# Altium schematic sheet LM5116.SchDoc
size A3; SheetNumber: 1; SheetTotal: 5
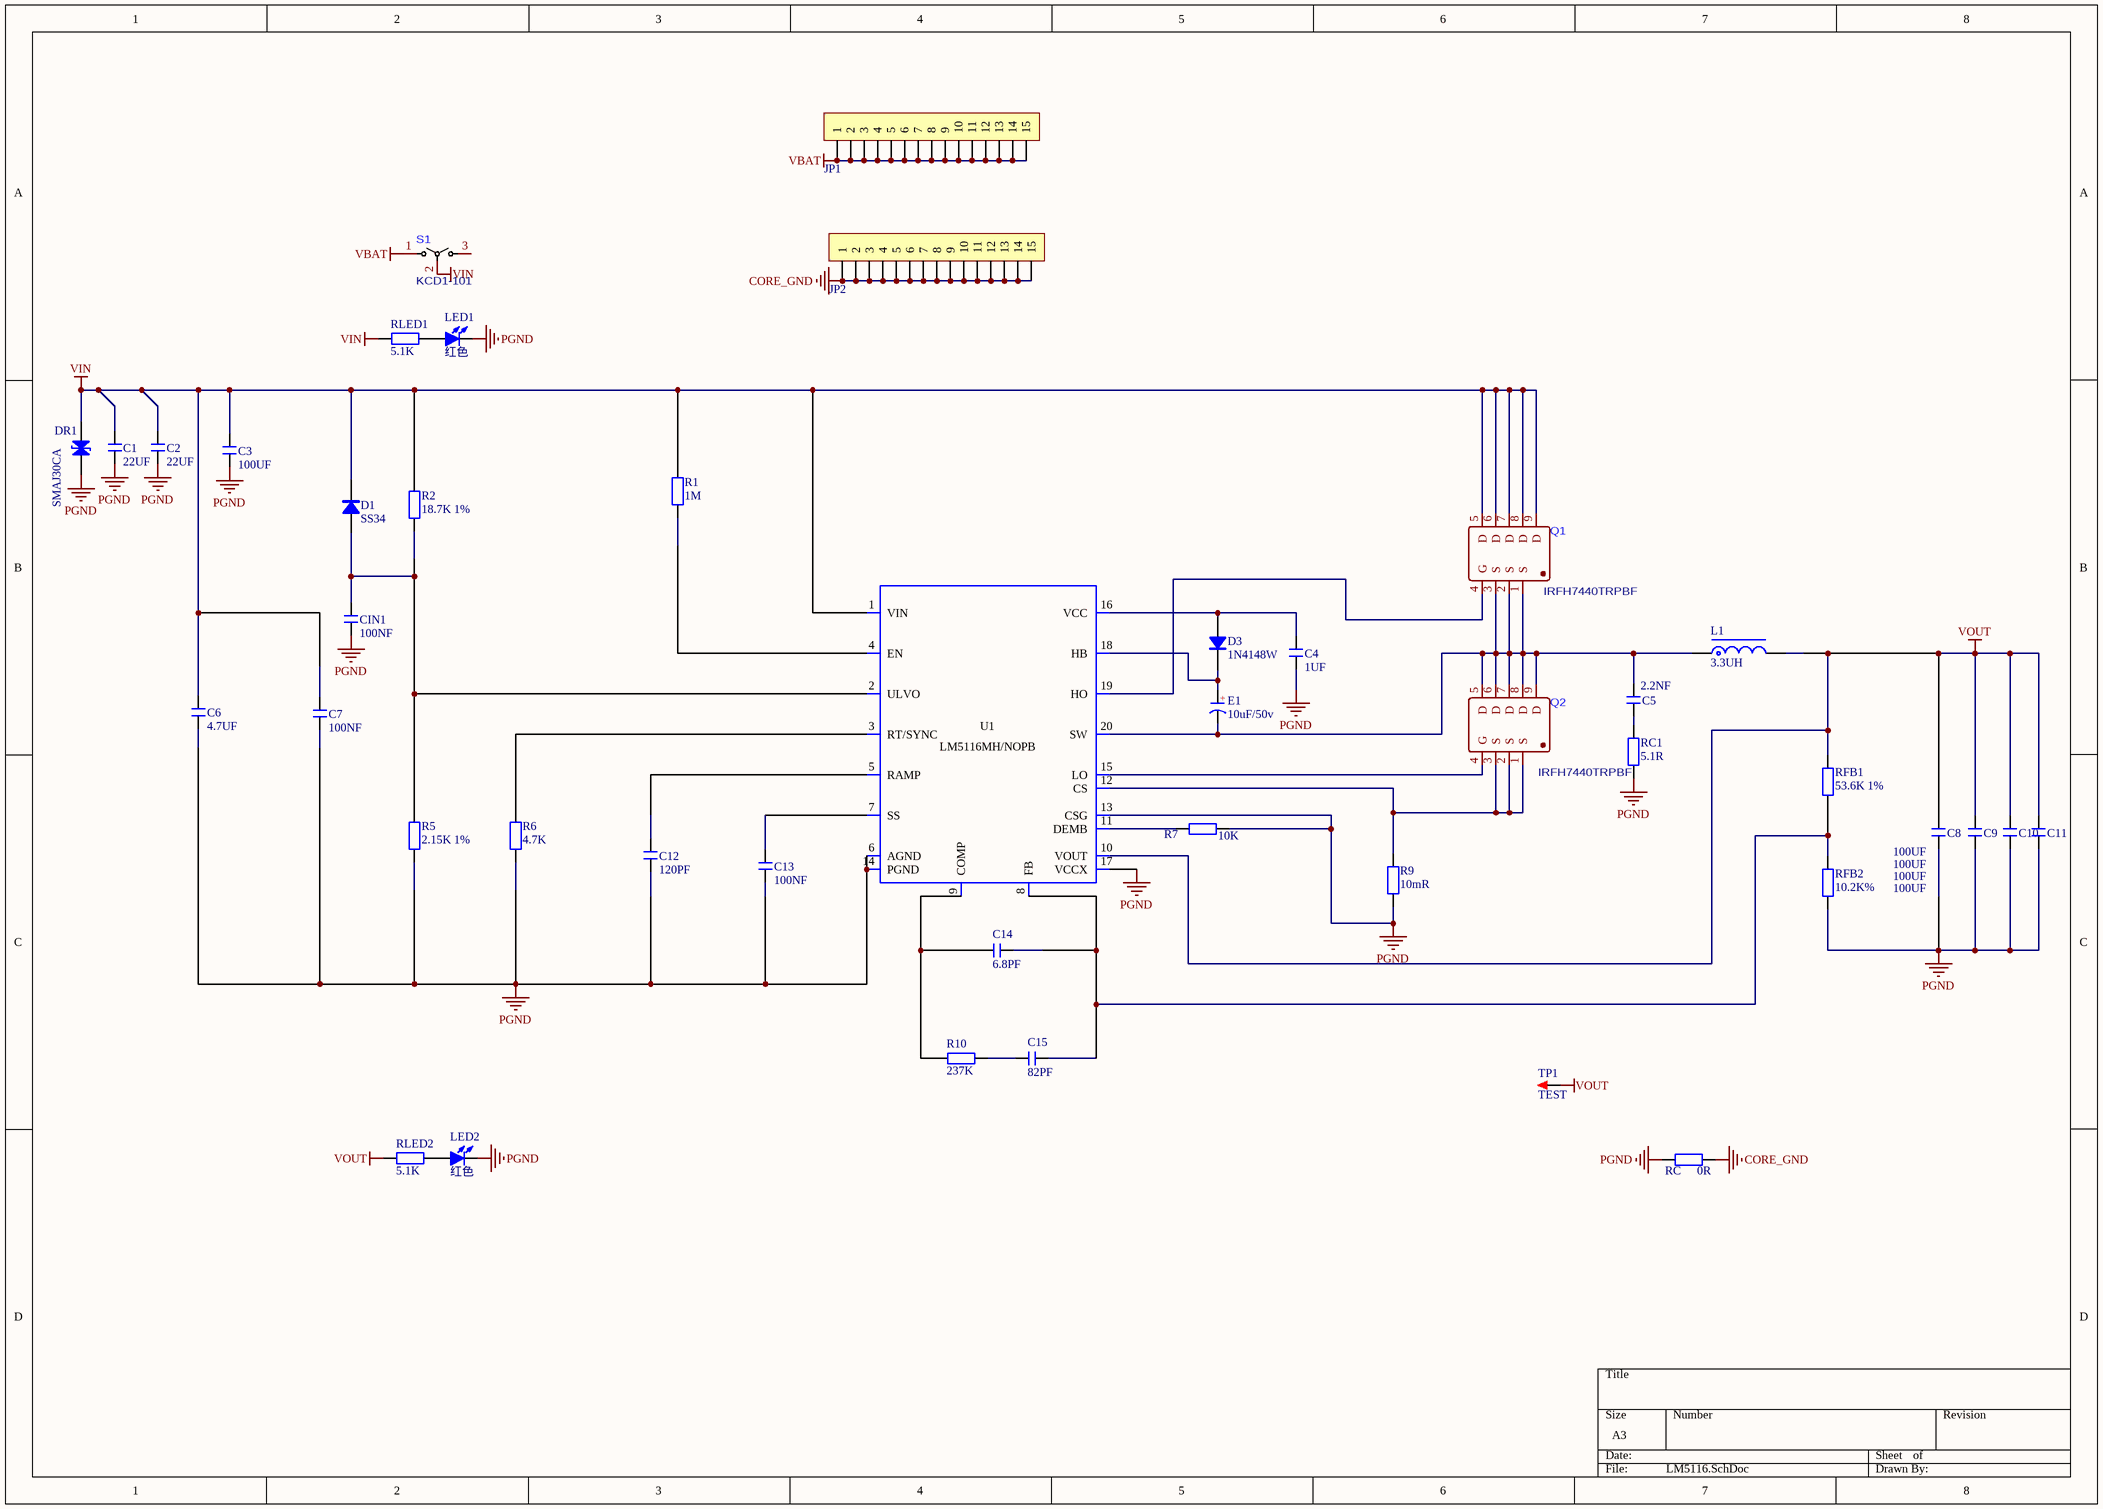
[diagram p0: LM5116.SchDoc]

## Parts
C1  22UF  [C 1206_L]
C2  22UF  [C 1206_L]
C3  100UF  [C 1210_L]
C4  1UF  [C 0805_L]
C5  2.2NF  [C 0805_L]
C6  4.7UF  [C 0805_L]
C7  100NF  [C 0805_L]
C8  100UF  [C 1210_L]
C9  100UF  [C 1210_L]
C10  100UF  [C 1210_L]
C11  100UF  [C 1210_L]
C12  120PF  [C 0805_L]
C13  100NF  [C 0805_L]
C14  6.8PF  [C 0805_L]
C15  82PF  [C 0805_L]
CIN1  100NF  [C 0805_L]
D1  SS34  [SMA]
D3  1N4148W  [SOD-123]
DR1  SMAJ30CA  [SMA]
E1  10uF/50v  [CAP 2.5*5*11-H]
JP1  HDR-1X15  [HDR2.54-LI-15P]  (value not drawn)
JP2  HDR-1X15  [HDR2.54-LI-15P]  (value not drawn)
L1  3.3UH  [SMD-L-1770]
LED1  红色  [LED 0805G]
LED2  红色  [LED 0805G]
Q1  IRFH7440TRPBF  [PQFN-8P_L5.8-W4.9-P1.27-LS6.0-BL]
Q2  IRFH7440TRPBF  [PQFN-8P_L5.8-W4.9-P1.27-LS6.0-BL]
R1  1M  [R 0805_L]
R2  18.7K 1%  [R 0805_L]
R5  2.15K 1%  [R 0805_L]
R6  4.7K  [R 0805_L]
R7  10K  [R 0805_L]
R9  10mR  [R 1206_L]
R10  237K  [R 0805_L]
RC  0R  [R 0805_L]
RC1  5.1R  [R 0805_L]
RFB1  53.6K 1%  [R 0805_L]
RFB2  10.2K%  [R 0805_L]
RLED1  5.1K  [R 0805_L]
RLED2  5.1K  [R 0805_L]
S1  KCD1-101  [KEY-TH_CN-KCD1-101-3P]
TP1  TEST  [TEST 1.6]
U1  LM5116MH/NOPB  [HTSSOP-20_L6.5-W4.4-P0.65-LS6.4-BL-EP]

## Nets
CORE_GND: JP2.1 JP2.2 JP2.3 JP2.4 JP2.5 JP2.6 JP2.7 JP2.8 JP2.9 JP2.10 JP2.11 JP2.12 JP2.13 JP2.14 JP2.15 RC.1
PGND: C1.1 C2.1 C3.1 C4.1 C6.1 C7.1 C8.2 C9.2 C10.2 C11.2 C12.1 C13.1 CIN1.1 DR1.2(K) LED1.2(K) LED2.2(K) R5.1 R6.1 R7.2 R9.1 RC.2 RC1.2 RFB2.2 U1.6(AGND) U1.13(CSG) U1.14(PGND) U1.17(VCCX) U1.21(EP)
VBAT: JP1.1 JP1.2 JP1.3 JP1.4 JP1.5 JP1.6 JP1.7 JP1.8 JP1.9 JP1.10 JP1.11 JP1.12 JP1.13 JP1.14 JP1.15 S1.1
VIN: C1.2 C2.2 C3.2 C6.2 C7.2 D1.2(K) DR1.1(A) Q1.5(D) Q1.6(D) Q1.7(D) Q1.8(D) Q1.9(D) R1.2 R2.2 RLED1.2 S1.2 U1.1(VIN)
VOUT: C8.1 C9.1 C10.1 C11.1 L1.2 RFB1.1 RLED2.2 TP1.1 U1.10(VOUT)
NetC4_2: C4.2 D3.1(A) U1.16(VCC)
NetC5_1: C5.1 RC1.1
NetC5_2: C5.2 E1.2(K) L1.1 Q1.1(S) Q1.2(S) Q1.3(S) Q2.5(D) Q2.6(D) Q2.7(D) Q2.8(D) Q2.9(D) U1.20(SW)
NetC12_2: C12.2 U1.5(RAMP)
NetC13_2: C13.2 U1.7(SS)
NetC14_1: C14.1 R10.2 U1.9(COMP)
NetC14_2: C14.2 C15.2 RFB1.2 RFB2.1 U1.8(FB)
NetC15_1: C15.1 R10.1
NetCIN1_2: CIN1.2 D1.1(A) R2.1 R5.2 U1.2(ULVO)
NetD3_2: D3.2(K) E1.1(A) U1.18(HB)
NetLED1_1: LED1.1(A) RLED1.1
NetLED2_1: LED2.1(A) RLED2.1
NetQ1_4: Q1.4(G) U1.19(HO)
NetQ2_1: Q2.1(S) Q2.2(S) Q2.3(S) R9.2 U1.12(CS)
NetQ2_4: Q2.4(G) U1.15(LO)
NetR1_1: R1.1 U1.4(EN)
NetR6_2: R6.2 U1.3(RT/SYNC)
NetR7_1: R7.1 U1.11(DEMB)

Not connected (* = marked no-connect by the designer): S1 3

## Notes on the sheet
- (in symbol C-CAP) +

## Library data of the parts
C1-C15 CIN1 = C: 无极性贴片电容; 版权归属: 源创客; 材质: X7R; BOM名称: 无极性贴片电容; 学习资源: www.ooocke.com
D1 D3 = SS34: 肖特基二极管; 版权归属: 源创客; 属性: 40V/3A; BOM名称: 肖特基二极管; 学习资源: www.ooocke.com
DR1 = DR: 瞬态电压抑制二极管; 版权归属: 源创客; BOM名称: 瞬态电压抑制二极管; 学习资源: www.ooocke.com
E1 = C-CAP: 直插电解电容; 版权归属: 源创客; BOM名称: 直插电解电容; 学习资源: www.ooocke.com
JP1 JP2 = Header 15: 15P接插件; 版权归属: 源创客; BOM名称: 15P接插件; 学习资源: www.ooocke.com
L1 = L-CD: 贴片功率电感; BOM名称: 功率电感; 版权归属: 源创客; 学习资源: www.ooocke.com
LED1 LED2 = LED-SMD: 贴片LED; 版权归属: 源创客; BOM名称: 贴片LED; 学习资源: www.ooocke.com
R1 R2 R5-R7 R9 R10 RC RC1 RFB1 RFB2 RLED1 RLED2 = R: 贴片电阻; 版权归属: 源创客; BOM名称: 贴片电阻; 学习资源: www.ooocke.com
S1 = CN-KCD1-101-3P
TP1 = TEST: 测试点; 版权归属: 源创客; BOM名称: 测试点; 学习资源: www.ooocke.com
U1 = LM5116MH/NOPB: Manufacturer Name: Texas Instruments; PackageReference: LM5116MH/NOPB; Manufacturer Part Number: LM5116MH/NOPB; Value: N/A